# EAGLE schematic SampleThing (EAGLE 7.7.0)
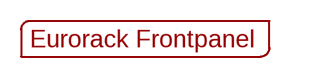
[diagram p0: schematic, sheet 1]

## Parts
U$1  EURORACK_PANEL12HP  [EURORACK12HPPANEL]

## Library data of the parts
U$1 = EurorackModularParts:EURORACK_PANEL